# Altium schematic sheet STM32_Module_V1.0.SchDoc
size A4
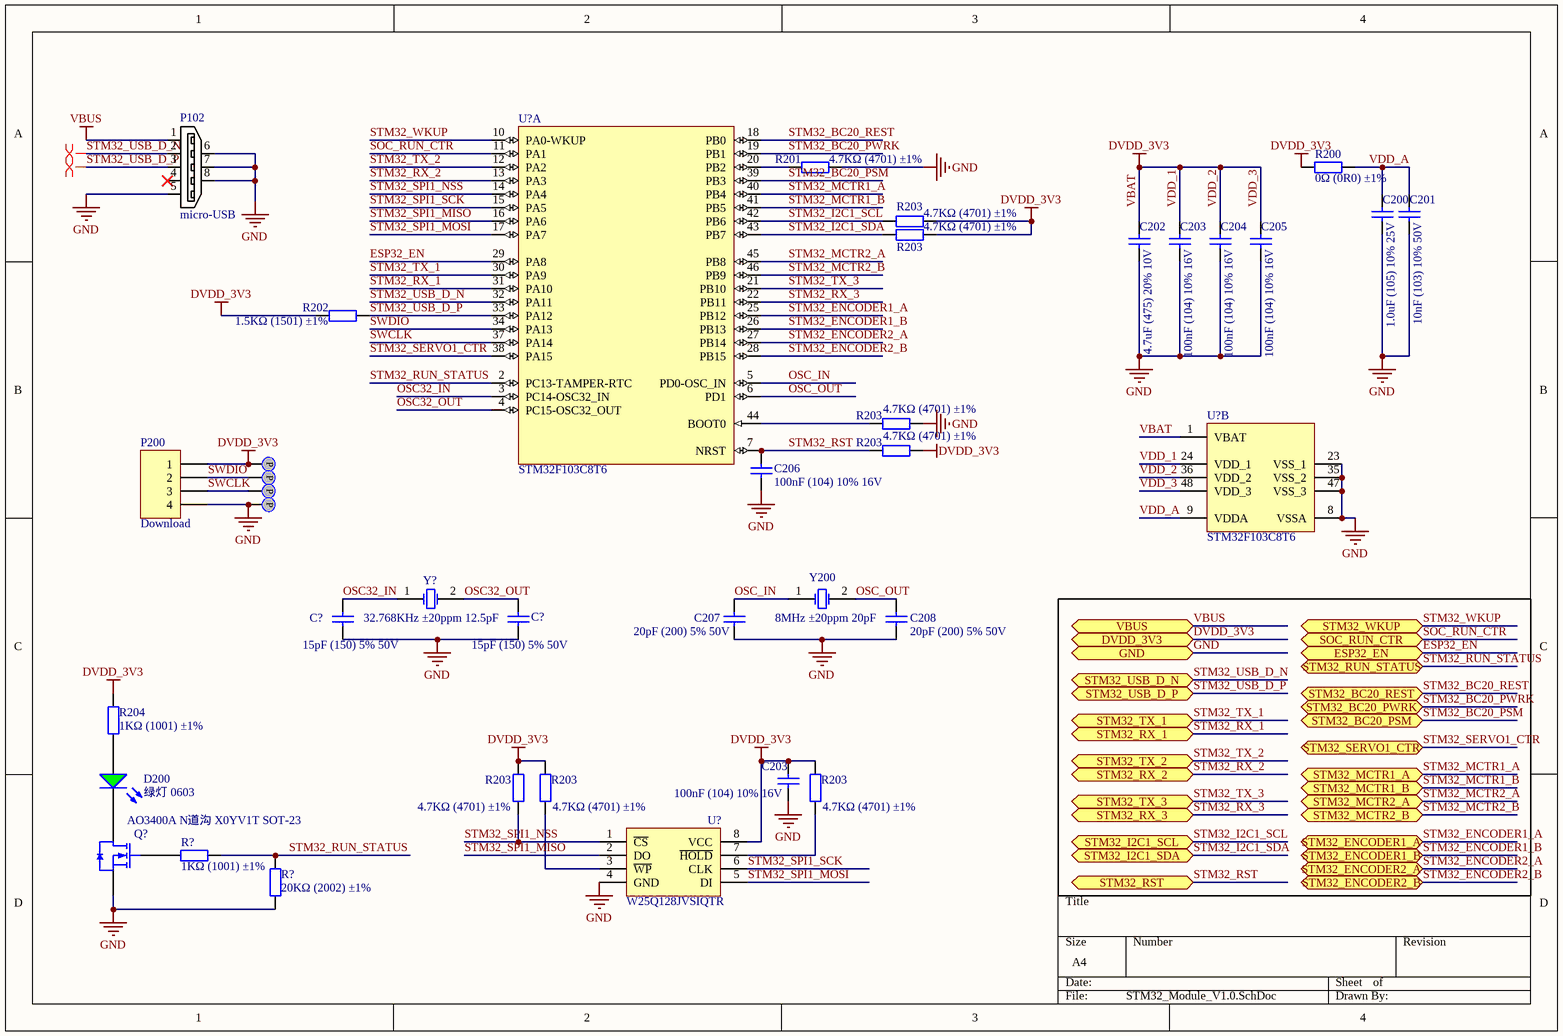
[diagram p0: STM32_Module_V1.0.SchDoc]

## Parts
(Parts that share a designator on the sheet are numbered #1, #2 ... from top to bottom, then left to right.)
C200  1.0uF (105) 10% 25V  [0402_C]
C201  10nF (103) 10% 50V  [0402_C]
C202  4.7uF (475) 20% 10V  [0402_C]
C203#1  100nF (104) 10% 16V  [0402_C]
C203#2  100nF (104) 10% 16V  [0402_C]
C204  100nF (104) 10% 16V  [0402_C]
C205  100nF (104) 10% 16V  [0402_C]
C206  100nF (104) 10% 16V  [0402_C]
C207  20pF (200) 5% 50V  [0402_C]
C208  20pF (200) 5% 50V  [0402_C]
C?#1  15pF (150) 5% 50V  [0402_C]
C?#2  15pF (150) 5% 50V  [0402_C]
D200  绿灯 0603  [0603_LED_S1]
P102  micro-USB  [USB_MICRO]
P200  Download  [HDR1X4]
Probe100  Test Point  [Probe]  (value not drawn)
Probe101  Test Point  [Probe]  (value not drawn)
Probe103  Test Point  [Probe]  (value not drawn)
Probe104  Test Point  [Probe]  (value not drawn)
Q?  AO3400A N道沟 X0YV1T SOT-23  [SOT-23-3L]
R200  0Ω (0R0) ±1%  [0402_R]
R201  4.7KΩ (4701) ±1%  [0402_R]
R202  1.5KΩ (1501) ±1%  [0402_R]
R203#1  4.7KΩ (4701) ±1%  [0402_R]
R203#2  4.7KΩ (4701) ±1%  [0402_R]
R203#3  4.7KΩ (4701) ±1%  [0402_R]
R203#4  4.7KΩ (4701) ±1%  [0402_R]
R203#5  4.7KΩ (4701) ±1%  [0402_R]
R203#6  4.7KΩ (4701) ±1%  [0402_R]
R203#7  4.7KΩ (4701) ±1%  [0402_R]
R204  1KΩ (1001) ±1%  [0603_R]
R?#1  1KΩ (1001) ±1%  [0402_R]
R?#2  20KΩ (2002) ±1%  [0402_R]
U?#1  STM32F103C8T6  [LQFP-48_7x7x05P]  (part A of 2)
U?#2  STM32F103C8T6  [LQFP-48_7x7x05P]  (part B of 2)
U?#3  W25Q128JVSIQTR  [SOIC-8_208mil]
Y200  8MHz ±20ppm 20pF  [SMD-5032_2P]
Y?  32.768KHz ±20ppm 12.5pF  [SMD-3215_2P FC - 135]

## Ports
DVDD_3V3, ESP32_EN, GND, SOC_RUN_CTR, STM32_BC20_PSM, STM32_BC20_PWRK, STM32_BC20_REST, STM32_ENCODER1_A, STM32_ENCODER1_B, STM32_ENCODER2_A, STM32_ENCODER2_B, STM32_I2C1_SCL, STM32_I2C1_SDA, STM32_MCTR1_A, STM32_MCTR1_B, STM32_MCTR2_A, STM32_MCTR2_B, STM32_RST, STM32_RUN_STATUS, STM32_RX_1, STM32_RX_2, STM32_RX_3, STM32_SERVO1_CTR, STM32_TX_1, STM32_TX_2, STM32_TX_3, STM32_USB_D_N, STM32_USB_D_P, STM32_WKUP, VBUS

## Nets
DVDD_3V3: C202.2 C203#1.2 C203#2.2 C204.2 C205.2 P200.1 Probe100.0 R200.1 R202.2 R203#1.2 R203#2.2 R203#4.2 R203#5.2 R203#6.2 R203#7.2 R204.2 U?#2.1(VBAT) U?#2.24(VDD_1) U?#2.36(VDD_2) U?#2.48(VDD_3) U?#3.8(VCC) ; port DVDD_3V3  [also labelled VBAT, VDD_1, VDD_2, VDD_3]
GND: C200.1 C201.1 C202.1 C203#1.1 C203#2.1 C204.1 C205.1 C206.2 C207.1 C208.1 C?#1.1 C?#2.1 P102.5(GND) P102.6(SHELL) P102.7(SHELL) P102.8(SHELL) P200.4 Probe104.0 Q?.2(S) R201.2 R203#3.2 R?#2.1 U?#2.8(VSSA) U?#2.23(VSS_1) U?#2.35(VSS_2) U?#2.47(VSS_3) U?#3.4(GND) ; port GND
VBUS: P102.1(VBUS) ; port VBUS
ESP32_EN: U?#1.29(PA8) ; port ESP32_EN
OSC32_IN: C?#1.2 U?#1.3(PC14-OSC32_IN) Y?.1(OSC1)
OSC32_OUT: C?#2.2 U?#1.4(PC15-OSC32_OUT) Y?.2(OSC2)
OSC_IN: C207.2 U?#1.5(PD0-OSC_IN) Y200.1(OSC1)
OSC_OUT: C208.2 U?#1.6(PD1) Y200.2(OSC2)
SOC_RUN_CTR: U?#1.11(PA1) ; port SOC_RUN_CTR
STM32_BC20_PSM: U?#1.39(PB3) ; port STM32_BC20_PSM
STM32_BC20_PWRK: U?#1.19(PB1) ; port STM32_BC20_PWRK
STM32_BC20_REST: U?#1.18(PB0) ; port STM32_BC20_REST
STM32_ENCODER1_A: U?#1.25(PB12) ; port STM32_ENCODER1_A
STM32_ENCODER1_B: U?#1.26(PB13) ; port STM32_ENCODER1_B
STM32_ENCODER2_A: U?#1.27(PB14) ; port STM32_ENCODER2_A
STM32_ENCODER2_B: U?#1.28(PB15) ; port STM32_ENCODER2_B
STM32_I2C1_SCL: R203#1.1 U?#1.42(PB6) ; port STM32_I2C1_SCL
STM32_I2C1_SDA: R203#2.1 U?#1.43(PB7) ; port STM32_I2C1_SDA
STM32_MCTR1_A: U?#1.40(PB4) ; port STM32_MCTR1_A
STM32_MCTR1_B: U?#1.41(PB5) ; port STM32_MCTR1_B
STM32_MCTR2_A: U?#1.45(PB8) ; port STM32_MCTR2_A
STM32_MCTR2_B: U?#1.46(PB9) ; port STM32_MCTR2_B
STM32_RST: C206.1 R203#4.1 U?#1.7(NRST) ; port STM32_RST
STM32_RUN_STATUS: R?#1.2 R?#2.2 U?#1.2(PC13-TAMPER-RTC) ; port STM32_RUN_STATUS
STM32_RX_1: U?#1.31(PA10) ; port STM32_RX_1
STM32_RX_2: U?#1.13(PA3) ; port STM32_RX_2
STM32_RX_3: U?#1.22(PB11) ; port STM32_RX_3
STM32_SERVO1_CTR: U?#1.38(PA15) ; port STM32_SERVO1_CTR
STM32_SPI1_MISO: U?#1.16(PA6) U?#3.2(DO)
STM32_SPI1_MOSI: U?#1.17(PA7) U?#3.5(DI)
STM32_SPI1_NSS: R203#5.1 U?#1.14(PA4) U?#3.1(~{CS})
STM32_SPI1_SCK: U?#1.15(PA5) U?#3.6(CLK)
STM32_TX_1: U?#1.30(PA9) ; port STM32_TX_1
STM32_TX_2: U?#1.12(PA2) ; port STM32_TX_2
STM32_TX_3: U?#1.21(PB10) ; port STM32_TX_3
STM32_USB_D_N: P102.2(D-) U?#1.32(PA11) ; port STM32_USB_D_N
STM32_USB_D_P: P102.3(D+) R202.1 U?#1.33(PA12) ; port STM32_USB_D_P
STM32_WKUP: U?#1.10(PA0-WKUP) ; port STM32_WKUP
SWCLK: P200.3 Probe103.0 U?#1.37(PA14)
SWDIO: P200.2 Probe101.0 U?#1.34(PA13)
VDD_A: C200.2 C201.2 R200.2 U?#2.9(VDDA)
NetD200_A: D200.A R204.1
NetD200_K: D200.K Q?.3(D)
NetQ?_1: Q?.1(G) R?#1.1
NetR201_1: R201.1 U?#1.20(PB2)
NetR203#3_1: R203#3.1 U?#1.44(BOOT0)
NetR203#6_1: R203#6.1 U?#3.3(~{WP})
NetR203#7_1: R203#7.1 U?#3.7(~{HOLD})

Not connected (* = marked no-connect by the designer): P102 4(ID)*

## Layout directives
differential pair: STM32_USB_D_N, STM32_USB_D_P

## Notes on the sheet
- (in symbol Test_Point) P

## Library data of the parts
C200 = 0402 1.0uF (105) 10% 25V: 贴片电容; ComponentLink1Description: 供应商链接; ComponentLink1URL: http://www.szlcsc.com/product/details_53938.html; Package: 0402; Supplier: LC; SuppliersPartNumber: C52923
C201 = 0402 10nF (103) 10% 50V: 贴片电容; ComponentLink1Description: 供应商链接; ComponentLink1URL: http://www.szlcsc.com/product/details_15869.html; Package: 0402; Supplier: LC; SuppliersPartNumber: C15195
C202 = 0402 4.7uF (475) 20% 10V: 贴片电容; ComponentLink1Description: 供应商链接; ComponentLink1URL: http://www.szlcsc.com/product/details_24469.html; Package: 0402; Supplier: LC; SuppliersPartNumber: C23733
C203#1 C203#2 C204-C206 = 0402 100nF (104) 10% 16V: 贴片电容; ComponentLink1Description: 供应商链接; ComponentLink1URL: http://www.szlcsc.com/product/details_1877.html; Package: 0402; Supplier: LC; SuppliersPartNumber: C1525
C207 C208 = 0402 20pF (200) 5% 50V: 贴片电容; ComponentLink1Description: 供应商链接; ComponentLink1URL: http://www.szlcsc.com/product/details_1906.html; Package: 0402; Supplier: LC; SuppliersPartNumber: C1554
C?#1 C?#2 = 0402 15pF (150) 5% 50V: 贴片电容; ComponentLink1Description: 供应商链接; ComponentLink1URL: http://www.szlcsc.com/product/details_1900.html; Package: 0402; Supplier: LC; SuppliersPartNumber: C1548
D200 = 0603 绿灯: 发光二极管; ComponentLink1Description: 供应商链接; ComponentLink1URL: http://www.szlcsc.com/product/details_73152.html; Package: 0603; Supplier: LC; SuppliersPartNumber: C72043
P200 = Header 4: Header, 4-Pin; LatestRevisionDate: 17-Jul-2002; LatestRevisionNote: Re-released for DXP Platform.; Publisher: Altium Limited
Probe100 Probe101 Probe103 Probe104 = Test_Point
Q? = AO3400A N道沟 X0YV1T SOT-23: MOS(场效应管); ComponentLink1Description: 供应商链接; ComponentLink1URL: http://www.szlcsc.com/product/details_21629.html; Package: SOT-23; Supplier: LC; SuppliersPartNumber: C20917
R200 = 0402 0Ω (0R0) 1%: 贴片电阻; ComponentLink1Description: 供应商链接; ComponentLink1URL: http://www.szlcsc.com/product/details_17853.html; Package: 0402; Supplier: LC; SuppliersPartNumber: C17168
R201 R203#1-R203#7 = 0402 4.7KΩ (4701) 1%: 贴片电阻; ComponentLink1Description: 供应商链接; ComponentLink1URL: http://www.szlcsc.com/product/details_26643.html; Package: 0402; Supplier: LC; SuppliersPartNumber: C25900
R202 = 0402 1.5KΩ (1501) 1%: 贴片电阻; ComponentLink1Description: 供应商链接; ComponentLink1URL: http://www.szlcsc.com/product/details_26610.html; Package: 0402; Supplier: LC; SuppliersPartNumber: C25867
R204 = 0603 1KΩ (1001) 1%: 贴片电阻; ComponentLink1Description: 供应商链接; ComponentLink1URL: http://www.szlcsc.com/product/details_21904.html; Package: 0603; Supplier: LC; SuppliersPartNumber: C21190
R?#1 = 0402 1KΩ (1001) 1%: 贴片电阻; ComponentLink1Description: 供应商链接; ComponentLink1URL: http://www.szlcsc.com/product/details_12256.html; Package: 0402; Supplier: LC; SuppliersPartNumber: C11702
R?#2 = 0402 20KΩ (2002) 1%: 贴片电阻; ComponentLink1Description: 供应商链接; ComponentLink1URL: http://www.szlcsc.com/product/details_26508.html; Package: 0402; Supplier: LC; SuppliersPartNumber: C25765
U?#1 U?#2 = STM32F103C8T6: ARM; ComponentLink1Description: 供应商链接; ComponentLink1URL: http://www.szlcsc.com/product/details_9243.html; Package: LQFP-48_7x7x05P; Supplier: LC; SuppliersPartNumber: C8734
U?#3 = W25Q128JVSIQTR_[C97521]: Flash ROM; ComponentLink1Description: 供应商链接; ComponentLink1URL: https://item.szlcsc.com/98729.html; Package: SOIC-8; Supplier: LC; SuppliersPartNumber: C97521
Y200 = SMD-5032_2P 8MHz 20ppm 20pF: 贴片晶振; ComponentLink1Description: 供应商链接; ComponentLink1URL: http://www.szlcsc.com/product/details_117214.html; Package: SMD-5032_2P; Supplier: LC; SuppliersPartNumber: C115962
Y? = SMD-3215_2P 32.768KHz 20ppm 12.5pF: 贴片晶振; ComponentLink1Description: 供应商链接; ComponentLink1URL: http://www.szlcsc.com/product/details_33310.html; Package: SMD-3215_2P; Supplier: LC; SuppliersPartNumber: C32346